# Altium schematic sheet Meios_pagamento.SchDoc: CONTROLADORA MAIS PIPOCA - REVISÃO EMC
size A3; DocumentNumber: 14; SheetNumber: 14; SheetTotal: 17
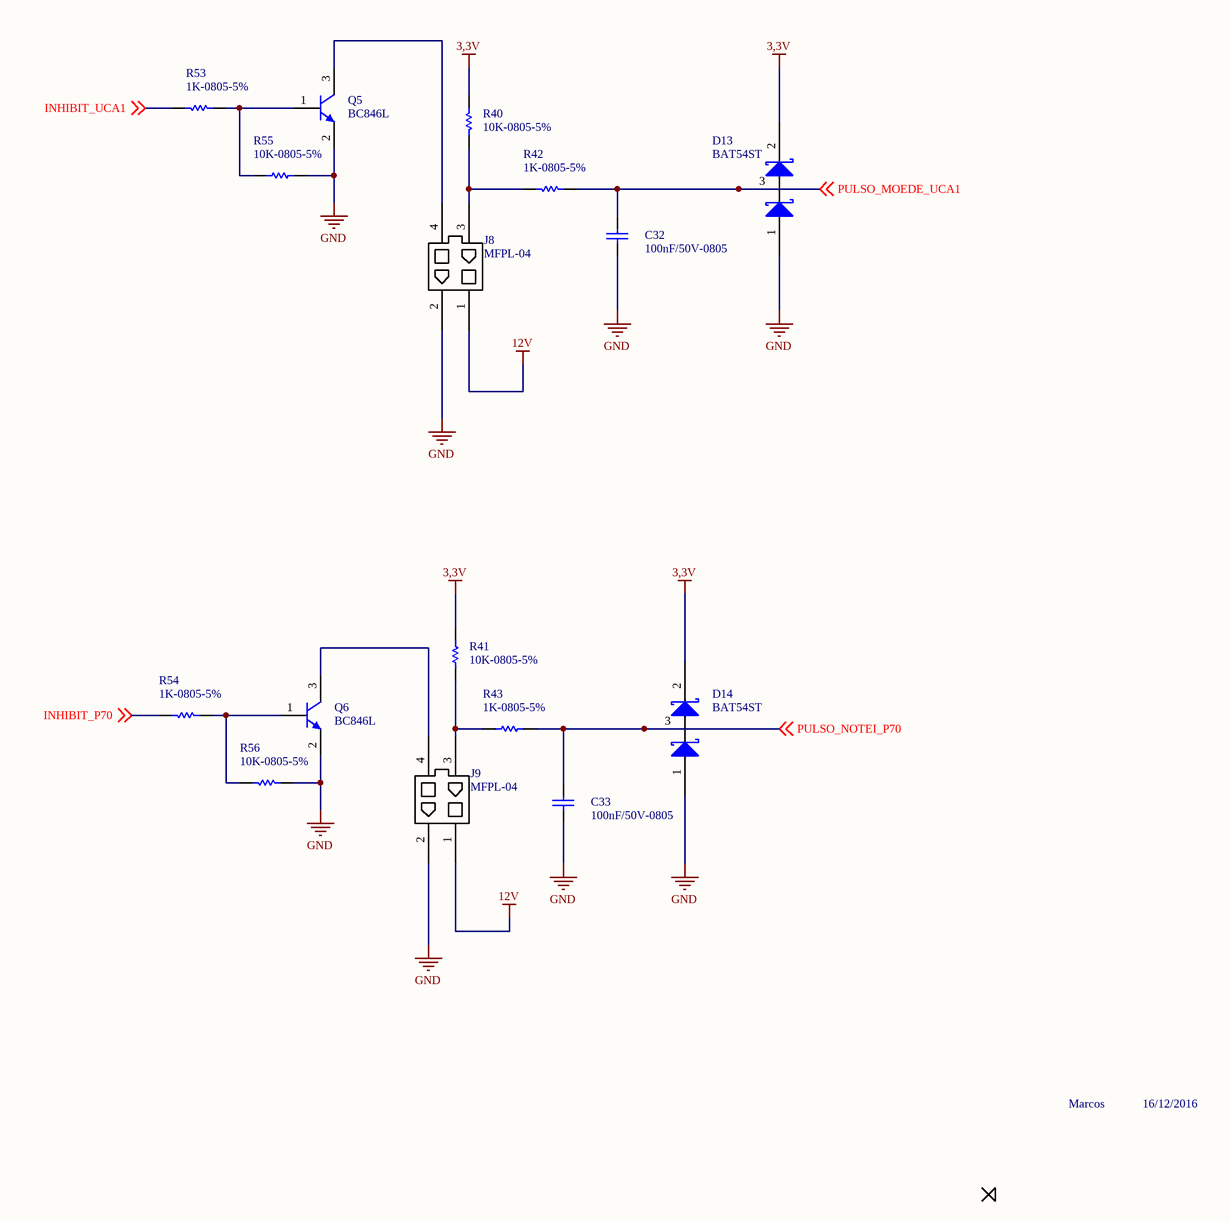
[diagram p0: Meios_pagamento.SchDoc]

## Parts
C32  100nF/50V-0805  [0805-REVISADO ONDA]
C33  100nF/50V-0805  [0805-REVISADO ONDA]
D13  BAT54ST  [SOT23 - REVISADO ONDA]
D14  BAT54ST  [SOT23 - REVISADO ONDA]
J8  MFPL-04
J9  MFPL-04
Q5  BC846L  [SOT23 - REVISADO ONDA]
Q6  BC846L  [SOT23 - REVISADO ONDA]
R40  10K-0805-5%  [0805-REVISADO ONDA]
R41  10K-0805-5%  [0805-REVISADO ONDA]
R42  1K-0805-5%  [0805-REVISADO ONDA]
R43  1K-0805-5%  [0805-REVISADO ONDA]
R53  1K-0805-5%  [0805-REVISADO ONDA]
R54  1K-0805-5%  [0805-REVISADO ONDA]
R55  10K-0805-5%  [0805-REVISADO ONDA]
R56  10K-0805-5%  [0805-REVISADO ONDA]

## Nets
3,3V: D13.2 D14.2 R40.2 R41.2
12V: J8.1 J9.1
GND: C32.1 C33.1 D13.1 D14.1 J8.2 J9.2 Q5.2(E) Q6.2(E) R55.2 R56.1
INHIBIT_P70: R54.2 ; off-sheet INHIBIT_P70
INHIBIT_UCA1: R53.2 ; off-sheet INHIBIT_UCA1
PULSO_MOEDE_UCA1: C32.2 D13.3 R42.1 ; off-sheet PULSO_MOEDE_UCA1
PULSO_NOTEI_P70: C33.2 D14.3 R43.2 ; off-sheet PULSO_NOTEI_P70
NetJ8_3: J8.3 R40.1 R42.2
NetJ8_4: J8.4 Q5.3(C)
NetJ9_3: J9.3 R41.1 R43.1
NetJ9_4: J9.4 Q6.3(C)
NetQ5_1: Q5.1(B) R53.1 R55.1
NetQ6_1: Q6.1(B) R54.1 R56.2

## Notes on the sheet
- Marcos
- 16/12/2016
- NOME
- DATA
- PROJETO
- DESCRIÇÃO
- desenho
- verif.
- aprov.
- TAMANHO
- CODIGO
- Todas as informações disponíveis
- não devem ser divulgadas,
- em parte ou todo.
- www.quarktee.com.br
- CIRCUITO IMPRESSO
- MONTAGEM ELETRÔNICA
- A4
- de

## Library data of the parts
C32 C33 = 100nF/50-0805-NPO: ERP: 104.11.005
Q5 Q6 = BC846: ERP: 106.22.001
R40 R41 R55 R56 = 10K-0805-5%: ERP: 102.11.054
R42 R43 R53 R54 = 1K-0805-5%: ERP: 102.11.042